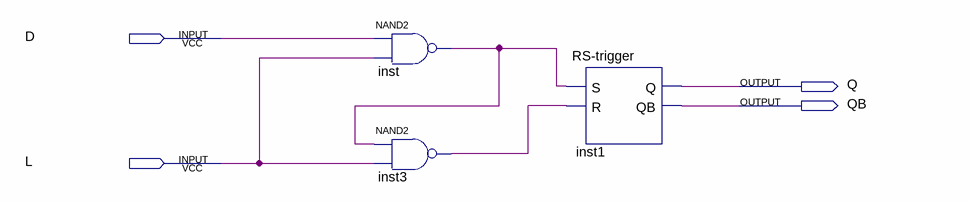
[diagram p0: schematic sheet]
// Quartus schematic D-trigger.bdf as structural Verilog: 3 symbols, 4 pins
module \D-trigger  (
  input  D,
  input  L,
  output Q,
  output QB
);

  wire inst3_out, inst_out;

  nand inst (inst_out, D, L);
  nand inst3 (inst3_out, inst_out, L);
  \RS-trigger  inst1 (.S(inst_out), .R(inst3_out), .Q(Q), .QB(QB));
endmodule
